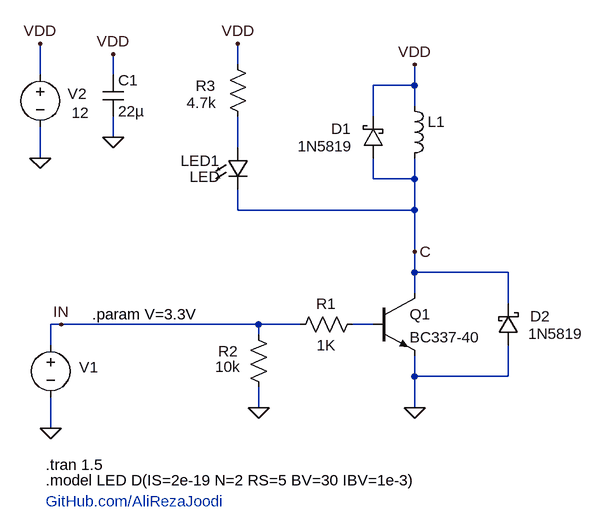
[diagram p0: schematic v1.1.asc]
v1.1.asc, the LTspice schematic file:
Version 4.1
SHEET 1 1332 680
WIRE 512 -112 512 -144
WIRE 208 -96 208 -144
WIRE 320 -96 320 -128
WIRE 784 -80 784 -112
WIRE 784 -80 720 -80
WIRE 784 -48 784 -80
WIRE 720 -32 720 -80
WIRE 320 0 320 -32
WIRE 512 16 512 -32
WIRE 208 32 208 -16
WIRE 720 64 720 32
WIRE 784 64 784 32
WIRE 784 64 720 64
WIRE 512 112 512 80
WIRE 784 112 784 64
WIRE 784 112 512 112
WIRE 784 176 784 112
WIRE 784 208 784 176
WIRE 928 208 784 208
WIRE 784 240 784 208
WIRE 928 256 928 208
WIRE 240 288 224 288
WIRE 544 288 240 288
WIRE 608 288 544 288
WIRE 720 288 688 288
WIRE 544 304 544 288
WIRE 224 320 224 288
WIRE 784 368 784 336
WIRE 928 368 928 320
WIRE 928 368 784 368
WIRE 544 416 544 384
WIRE 784 416 784 368
WIRE 224 448 224 400
FLAG 224 448 0
FLAG 208 32 0
FLAG 240 288 IN
FLAG 784 416 0
FLAG 208 -144 VDD
FLAG 784 -112 VDD
FLAG 512 -144 VDD
FLAG 320 0 0
FLAG 320 -128 VDD
FLAG 544 416 0
FLAG 784 176 C
SYMBOL voltage 224 304 R0
WINDOW 123 0 0 Left 0
WINDOW 39 0 0 Left 0
WINDOW 0 44 50 Left 2
WINDOW 3 43 83 Invisible 2
SYMATTR InstName V1
SYMATTR Value PULSE(0 {V} 0.5 1n 1n 0.5 1 1)
SYMBOL res 592 304 R270
WINDOW 0 32 56 VTop 2
WINDOW 3 0 56 VBottom 2
SYMATTR InstName R1
SYMATTR Value 1K
SYMBOL voltage 208 -112 R0
WINDOW 123 0 0 Left 0
WINDOW 39 0 0 Left 0
WINDOW 0 42 45 Left 2
WINDOW 3 48 74 Left 2
SYMATTR InstName V2
SYMATTR Value 12
SYMBOL npn 720 240 R0
SYMATTR InstName Q1
SYMATTR Value BC337-40
SYMBOL res 528 288 R0
WINDOW 0 -46 41 Left 2
WINDOW 3 -51 65 Left 2
SYMATTR InstName R2
SYMATTR Value 10k
SYMBOL ind 768 -64 R0
WINDOW 3 39 80 Invisible 2
SYMATTR Value 25m
SYMATTR InstName L1
SYMATTR SpiceLine Rser=100
SYMBOL res 496 -128 R0
WINDOW 0 -49 49 Left 2
WINDOW 3 -63 75 Left 2
SYMATTR InstName R3
SYMATTR Value 4.7k
SYMBOL schottky 736 32 R180
WINDOW 0 50 45 Left 2
WINDOW 3 47 18 Left 2
SYMATTR InstName D1
SYMATTR Value 1N5819
SYMBOL cap 304 -96 R0
SYMATTR InstName C1
SYMATTR Value 22µ
SYMBOL LED 496 16 R0
WINDOW 0 -72 20 Left 2
WINDOW 3 -58 45 Left 2
SYMATTR InstName LED1
SYMATTR Value LED
SYMBOL schottky 912 320 M180
WINDOW 0 50 45 Left 2
WINDOW 3 47 18 Left 2
SYMATTR InstName D2
SYMATTR Value 1N5819
TEXT 216 504 Left 2 !.tran 1.5
TEXT 216 528 Left 2 !.model LED D(IS=2e-19 N=2 RS=5 BV=30 IBV=1e-3)
TEXT 216 560 Left 2 ;GitHub.com/AliRezaJoodi
TEXT 288 272 Left 2 !.param V=3.3V

The netlist it stands for:
* v1.1.asc
V1 IN 0 PULSE(0 {V} 0.5 1n 1n 0.5 1 1)
R1 IN N002 1K
V2 VDD 0 12
Q1 C N002 0 0 BC337-40
R2 IN 0 10k
L1 VDD C 25m Rser=100
R3 VDD N001 4.7k
D1 C VDD 1N5819
C1 VDD 0 22µ
D§LED1 N001 C LED
D2 0 C 1N5819
.model D D
.lib standard.dio
.model NPN NPN
.model PNP PNP
.lib standard.bjt
.tran 1.5
.model LED D(IS=2e-19 N=2 RS=5 BV=30 IBV=1e-3)
* GitHub.com/AliRezaJoodi
.param V=3.3V
.backanno
.end